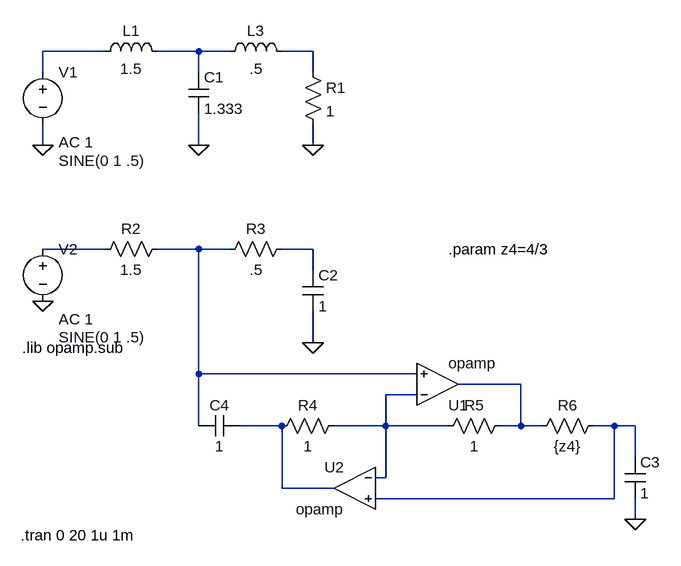
[diagram p0: schematic circuito-full.asc]
circuito-full.asc, the LTspice schematic file:
Version 4
SHEET 1 984 1080
WIRE 128 96 32 96
WIRE 272 96 208 96
WIRE 320 96 272 96
WIRE 448 96 400 96
WIRE 32 128 32 96
WIRE 272 128 272 96
WIRE 448 128 448 96
WIRE 32 240 32 208
WIRE 272 240 272 192
WIRE 448 240 448 208
WIRE 128 400 32 400
WIRE 272 400 208 400
WIRE 320 400 272 400
WIRE 448 400 400 400
WIRE 448 432 448 400
WIRE 448 544 448 496
WIRE 272 592 272 400
WIRE 608 592 272 592
WIRE 768 608 672 608
WIRE 608 624 560 624
WIRE 272 672 272 592
WIRE 400 672 336 672
WIRE 560 672 560 624
WIRE 560 672 480 672
WIRE 656 672 560 672
WIRE 768 672 768 608
WIRE 768 672 736 672
WIRE 800 672 768 672
WIRE 912 672 880 672
WIRE 944 672 912 672
WIRE 944 720 944 672
WIRE 560 752 560 672
WIRE 560 752 544 752
WIRE 400 768 400 672
WIRE 480 768 400 768
WIRE 912 784 912 672
WIRE 912 784 544 784
WIRE 944 816 944 784
FLAG 32 240 0
FLAG 272 240 0
FLAG 448 240 0
FLAG 448 544 0
FLAG 944 816 0
FLAG 32 480 0
SYMBOL voltage 32 112 R0
WINDOW 3 24 152 Left 2
WINDOW 123 24 124 Left 2
WINDOW 39 0 0 Left 0
SYMATTR InstName V1
SYMATTR Value SINE(0 1 .5)
SYMATTR Value2 AC 1
SYMBOL ind 112 112 R270
WINDOW 0 32 56 VTop 2
WINDOW 3 5 56 VBottom 2
SYMATTR InstName L1
SYMATTR Value 1.5
SYMBOL ind 304 112 R270
WINDOW 0 32 56 VTop 2
WINDOW 3 5 56 VBottom 2
SYMATTR InstName L3
SYMATTR Value .5
SYMBOL cap 256 128 R0
SYMATTR InstName C1
SYMATTR Value 1.333
SYMBOL res 432 112 R0
SYMATTR InstName R1
SYMATTR Value 1
SYMBOL res 224 384 R90
WINDOW 0 0 56 VBottom 2
WINDOW 3 32 56 VTop 2
SYMATTR InstName R2
SYMATTR Value 1.5
SYMBOL res 416 384 R90
WINDOW 0 0 56 VBottom 2
WINDOW 3 32 56 VTop 2
SYMATTR InstName R3
SYMATTR Value .5
SYMBOL cap 432 432 R0
SYMATTR InstName C2
SYMATTR Value 1
SYMBOL OpAmps\\opamp 640 672 M180
SYMATTR InstName U1
SYMATTR SpiceLine Aol=10000K
SYMATTR SpiceLine2 GBW=1000Meg
SYMBOL OpAmps\\opamp 512 704 M0
SYMATTR InstName U2
SYMATTR SpiceLine Aol=10000K
SYMATTR SpiceLine2 GBW=1000Meg
SYMBOL res 496 656 R90
WINDOW 0 0 56 VBottom 2
WINDOW 3 32 56 VTop 2
SYMATTR InstName R4
SYMATTR Value 1
SYMBOL res 752 656 R90
WINDOW 0 0 56 VBottom 2
WINDOW 3 32 56 VTop 2
SYMATTR InstName R5
SYMATTR Value 1
SYMBOL res 896 656 R90
WINDOW 0 0 56 VBottom 2
WINDOW 3 32 56 VTop 2
SYMATTR InstName R6
SYMATTR Value {z4}
SYMBOL cap 928 720 R0
SYMATTR InstName C3
SYMATTR Value 1
SYMBOL cap 336 656 R90
WINDOW 0 0 32 VBottom 2
WINDOW 3 32 32 VTop 2
SYMATTR InstName C4
SYMATTR Value 1
SYMBOL voltage 32 384 R0
WINDOW 3 24 152 Left 2
WINDOW 123 24 124 Left 2
WINDOW 39 0 0 Left 0
SYMATTR InstName V2
SYMATTR Value SINE(0 1 .5)
SYMATTR Value2 AC 1
TEXT 0 552 Left 2 !.lib opamp.sub
TEXT 656 400 Left 2 !.param z4=4/3
TEXT -2 840 Left 2 !.tran 0 20 1u 1m

The netlist it stands for:
* circuito-full.asc
V1 N001 0 SINE(0 1 .5) AC 1
L1 N001 N002 1.5
L3 N002 N003 .5
C1 N002 0 1.333
R1 N003 0 1
R2 N005 N004 1.5
R3 N006 N005 .5
C2 N006 0 1
XU1 N008 N005 N007 opamp Aol=10000K GBW=1000Meg  ; pins invin noninvin out
XU2 N008 N010 N009 opamp Aol=10000K GBW=1000Meg  ; pins invin noninvin out
R4 N008 N009 1
R5 N007 N008 1
R6 N010 N007 {z4}
C3 N010 0 1
C4 N009 N005 1
V2 N004 0 SINE(0 1 .5) AC 1
.lib opamp.sub
.param z4=4/3
.tran 0 20 1u 1m
.backanno
.end